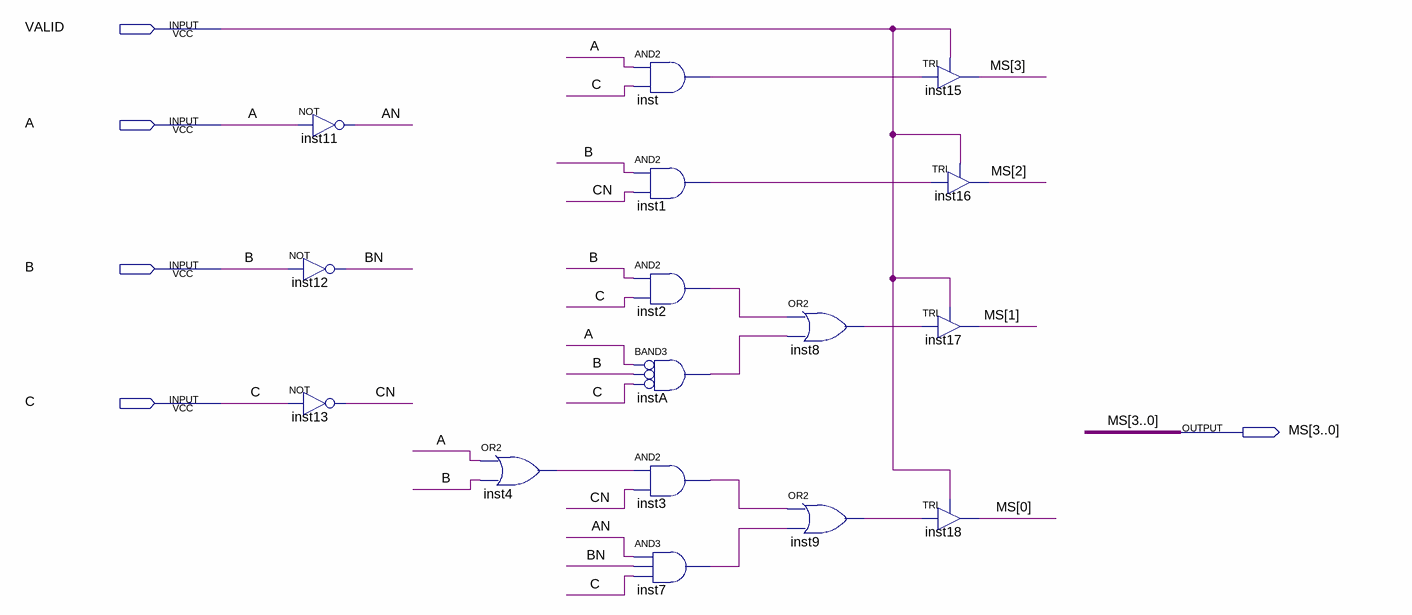
[diagram p0: schematic sheet]
// Quartus schematic DECODER.bdf as structural Verilog: 16 symbols, 5 pins
module DECODER (
  input  VALID,
  input  A,
  input  B,
  input  C,
  output [3:0] MS
);

  wire AN, BN, CN, inst1_out, inst2_out, inst3_out, inst4_out, inst7_out, inst8_out, inst9_out, inst_out,
       instA_out;

  not inst11 (AN, A);
  not inst12 (BN, B);
  not inst13 (CN, C);
  or inst4 (inst4_out, A, B);
  and inst (inst_out, A, C);
  and inst1 (inst1_out, B, CN);
  and inst2 (inst2_out, B, C);
  and instA (instA_out, ~A, ~B, ~C);  // BAND3
  and inst3 (inst3_out, inst4_out, CN);
  and inst7 (inst7_out, AN, BN, C);
  or inst8 (inst8_out, inst2_out, instA_out);
  or inst9 (inst9_out, inst3_out, inst7_out);
  TRI inst15 (.IN(inst_out), .OE(VALID), .OUT(MS[3]));
  TRI inst16 (.IN(inst1_out), .OE(VALID), .OUT(MS[2]));
  TRI inst17 (.IN(inst8_out), .OE(VALID), .OUT(MS[1]));
  TRI inst18 (.IN(inst9_out), .OE(VALID), .OUT(MS[0]));
endmodule
